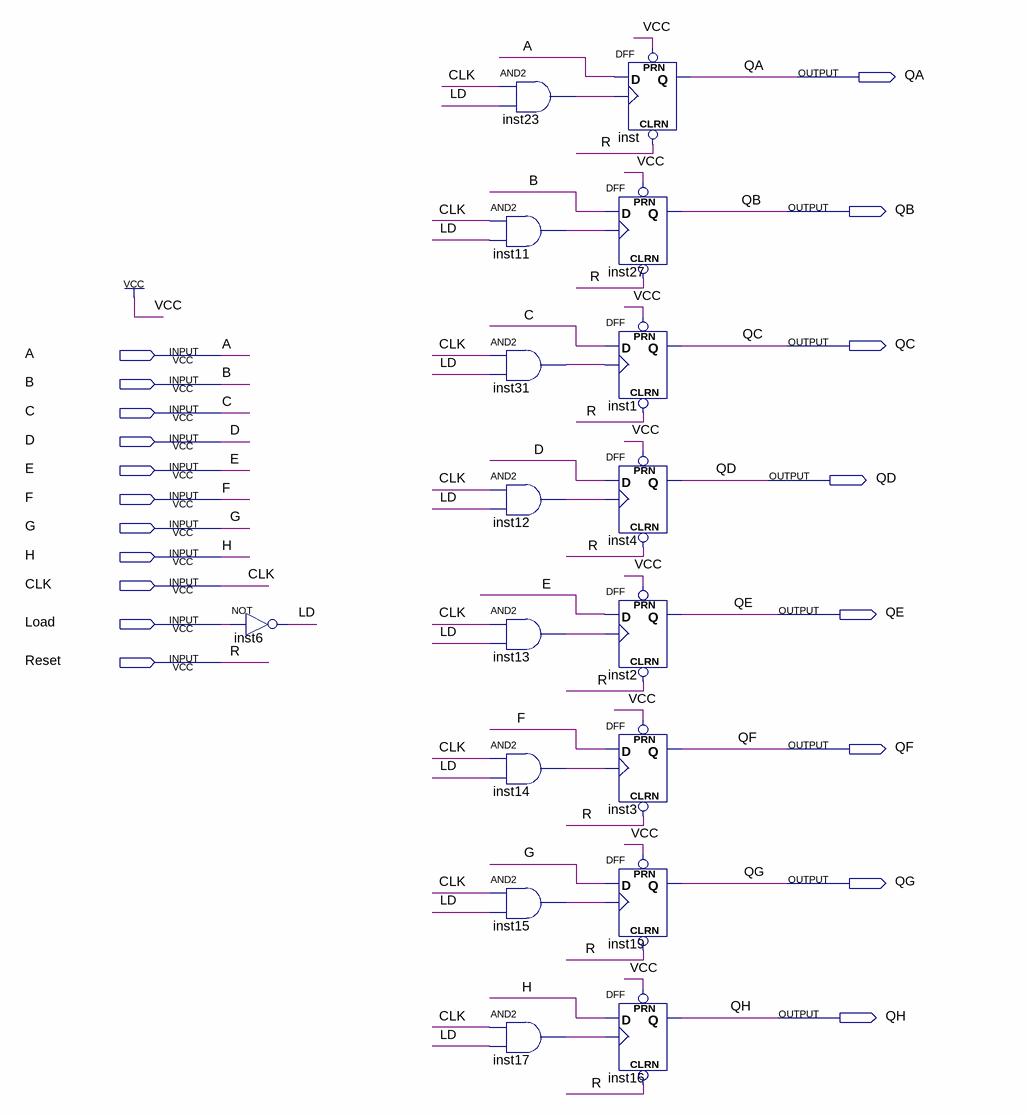
[diagram p0: schematic sheet]
// Quartus schematic Register8bit.bdf as structural Verilog: 17 symbols, 19 pins
module Register8bit (
  input  A,
  input  B,
  input  C,
  input  D,
  input  E,
  input  F,
  input  G,
  input  H,
  input  CLK,
  input  Load,
  input  Reset,
  output QA,
  output QB,
  output QC,
  output QD,
  output QE,
  output QF,
  output QG,
  output QH
);

  wire inst11_out, inst12_out, inst13_out, inst14_out, inst15_out, inst17_out, inst23_out, inst31_out, LD;

  not inst6 (LD, Load);
  and inst23 (inst23_out, CLK, LD);
  and inst11 (inst11_out, CLK, LD);
  and inst31 (inst31_out, CLK, LD);
  and inst12 (inst12_out, CLK, LD);
  and inst13 (inst13_out, CLK, LD);
  and inst14 (inst14_out, CLK, LD);
  and inst15 (inst15_out, CLK, LD);
  and inst17 (inst17_out, CLK, LD);
  DFF inst (.CLRN(Reset), .CLK(inst23_out), .D(A), .PRN(1'b1), .Q(QA));
  DFF inst27 (.CLRN(Reset), .CLK(inst11_out), .D(B), .PRN(1'b1), .Q(QB));
  DFF inst1 (.CLRN(Reset), .CLK(inst31_out), .D(C), .PRN(1'b1), .Q(QC));
  DFF inst4 (.CLRN(Reset), .CLK(inst12_out), .D(D), .PRN(1'b1), .Q(QD));
  DFF inst2 (.CLRN(Reset), .CLK(inst13_out), .D(E), .PRN(1'b1), .Q(QE));
  DFF inst3 (.CLRN(Reset), .CLK(inst14_out), .D(F), .PRN(1'b1), .Q(QF));
  DFF inst19 (.CLRN(Reset), .CLK(inst15_out), .D(G), .PRN(1'b1), .Q(QG));
  DFF inst16 (.CLRN(Reset), .CLK(inst17_out), .D(H), .PRN(1'b1), .Q(QH));

  // Other names for the same wires on the sheet: R = Reset
endmodule
